# Altium project Raspberry_etherIO_v2.PrjPcb
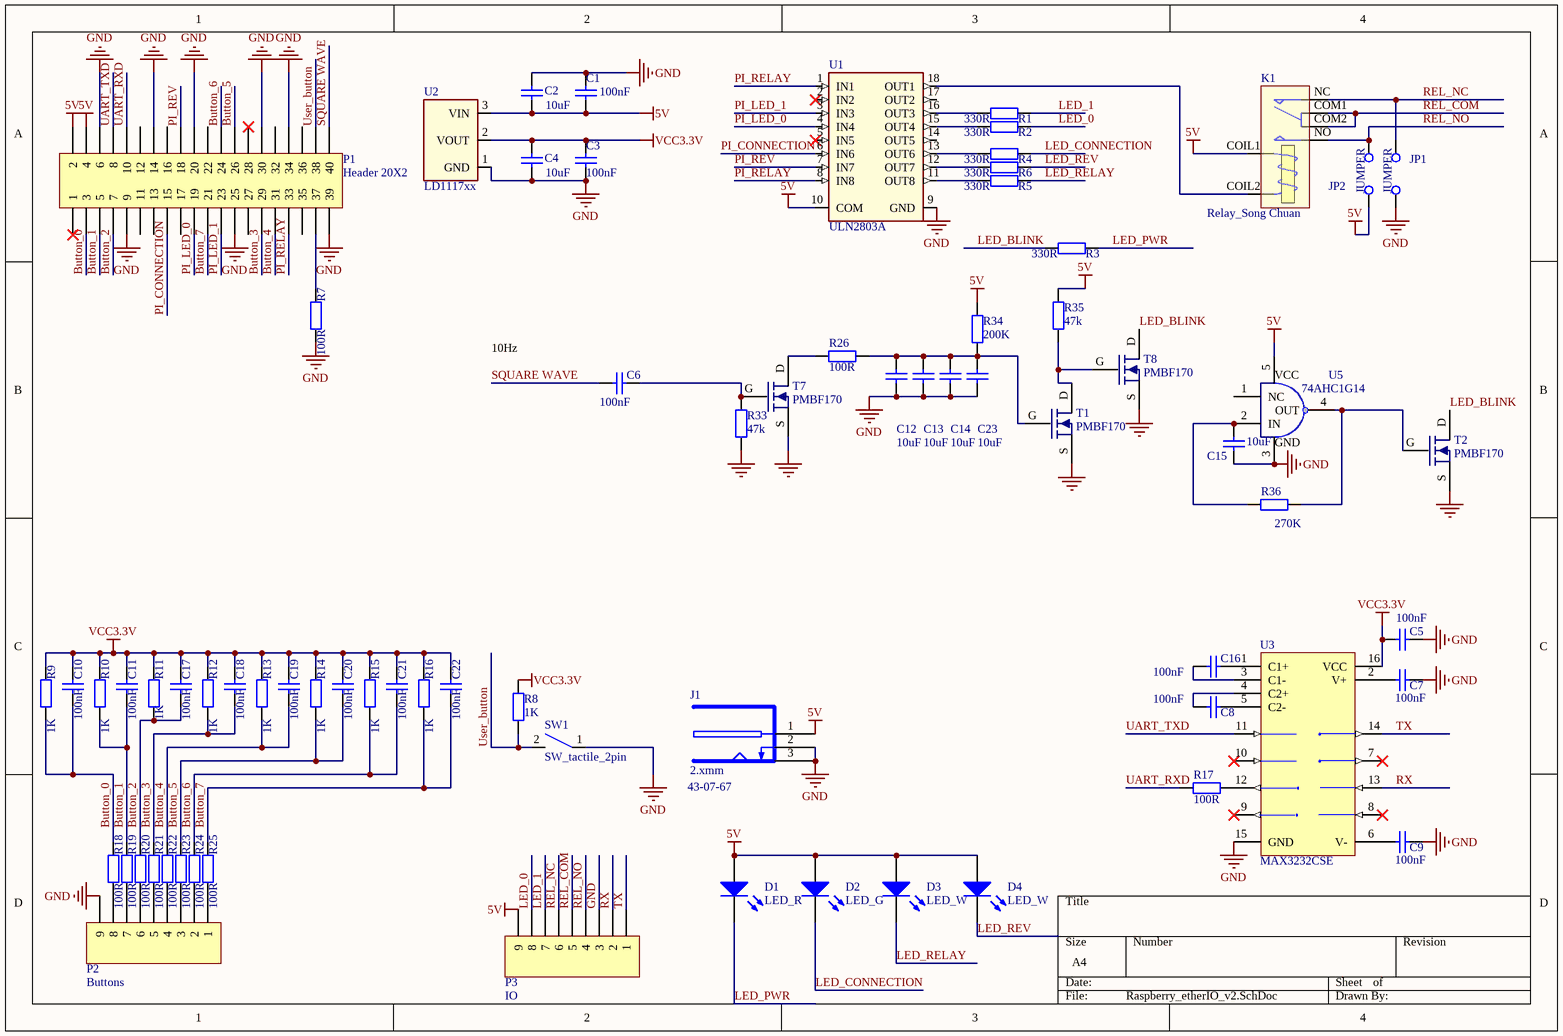
[diagram p0: Raspberry_etherIO_v2.SchDoc]
1 sheet, 73 parts. Net scope: global (net labels, ports and power ports of the same name join across sheets).
Board file: Raspberry_etherIO_v2.PcbDoc

## Sheet Raspberry_etherIO_v2.SchDoc
size A4

### Parts
C1  100nF  [FP_0603_CAP_080]
C2  10uF  [FP_1206_CAP_085]
C3  100nF  [FP_0603_CAP_080]
C4  10uF  [FP_1206_CAP_085]
C5  100nF  [FP_0603_CAP_080]
C6  100nF  [FP_0603_CAP_080]
C7  100nF  [FP_0603_CAP_080]
C8  100nF  [FP_0603_CAP_080]
C9  100nF  [FP_0603_CAP_080]
C10  100nF  [FP_0603_CAP_080]
C11  100nF  [FP_0603_CAP_080]
C12  10uF  [FP_1206_CAP_085]
C13  10uF  [FP_1206_CAP_085]
C14  10uF  [FP_1206_CAP_085]
C15  10uF  [FP_0603_CAP_080]
C16  100nF  [FP_0603_CAP_080]
C17  100nF  [FP_0603_CAP_080]
C18  100nF  [FP_0603_CAP_080]
C19  100nF  [FP_0603_CAP_080]
C20  100nF  [FP_0603_CAP_080]
C21  100nF  [FP_0603_CAP_080]
C22  100nF  [FP_0603_CAP_080]
C23  10uF  [FP_1206_CAP_085]
D1  LED_R  [1206 LED Reversed]
D2  LED_G  [1206 LED Reversed]
D3  LED_W  [1206 LED Reversed]
D4  LED_W  [1206 LED Reversed]
J1  2.xmm  Order info: 43-07-67  [FP_DC_TAP_ANYA]
JP1  JUMPER  [FP_CONN2_TUSKE_254MM]
JP2  JUMPER  [FP_CONN2_TUSKE_254MM]
K1  Relay_Song Chuan  [Relay_Song Chuan]
P1  Header 20X2  [Header_2X20_pin_2.54]
P2  Buttons  [Euroblock 3.5pitch 9P]
P3  IO  [Euroblock 3.5pitch 9P]
R1  330R  [FP_0603_RES]
R2  330R  [FP_0603_RES]
R3  330R  [FP_0603_RES]
R4  330R  [FP_0603_RES]
R5  330R  [FP_0603_RES]
R6  330R  [FP_0603_RES]
R7  100R  [FP_0603_RES]
R8  1K  [FP_0603_RES]
R9  1K  [FP_0603_RES]
R10  1K  [FP_0603_RES]
R11  1K  [FP_0603_RES]
R12  1K  [FP_0603_RES]
R13  1K  [FP_0603_RES]
R14  1K  [FP_0603_RES]
R15  1K  [FP_0603_RES]
R16  1K  [FP_0603_RES]
R17  100R  [FP_0603_RES]
R18  100R  [FP_0603_RES]
R19  100R  [FP_0603_RES]
R20  100R  [FP_0603_RES]
R21  100R  [FP_0603_RES]
R22  100R  [FP_0603_RES]
R23  100R  [FP_0603_RES]
R24  100R  [FP_0603_RES]
R25  100R  [FP_0603_RES]
R26  100R  [FP_0603_RES]
R33  47k  [FP_0603_RES]
R34  200K  [FP_0603_RES]
R35  47k  [FP_0603_RES]
R36  270K  [FP_0603_RES]
SW1  SW_tactile_2pin  [SW_TACT_2PIN]
T1  PMBF170  [FET_SOT23]
T2  PMBF170  [FET_SOT23]
T7  PMBF170  [FET_SOT23]
T8  PMBF170  [FET_SOT23]
U1  ULN2803A  [DIGITAL_SOIC18W]
U2  LD1117xx  [SUPPLY_SOT223]
U3  MAX3232CSE  [DIGITAL_SOIC16]
U5  74AHC1G14  [GATE_SOT23-5]

### Nets
5V: C1.2 C2.1 D1.1(A) D2.1(A) D3.1(A) D4.1(A) J1.1(9V) JP2.1(C1) K1.COIL1 P1.2 P1.4 P3.9 R34.2 R35.2 U1.10(COM) U2.3(VIN) U5.5(VCC)
GND: C1.1 C2.2 C3.2 C4.1 C5.2 C7.2 C9.2 C12.1 C13.1 C14.1 C15.1 C23.1 J1.2(GND) J1.3(GND) JP1.1(C1) P1.6 P1.9 P1.14 P1.20 P1.25 P1.30 P1.34 P1.39 P2.9 P3.3 R7.1 R33.1 SW1.1 T1.S T2.S T7.S T8.S U1.9(GND) U2.1(GND) U3.15(GND) U5.3(GND)
VCC3.3V: C3.1 C4.2 C5.1 C10.2 C11.2 C17.2 C18.2 C19.2 C20.2 C21.2 C22.2 R8.1 R9.2 R10.2 R11.2 R12.2 R13.2 R14.2 R15.2 R16.2 U2.2(VOUT) U3.16(VCC)
Button_0: C10.1 P1.3 R9.1 R18.2
Button_1: C11.1 P1.5 R10.1 R19.2
Button_2: C17.1 P1.7 R11.1 R20.2
Button_3: C18.1 P1.29 R12.1 R21.2
Button_4: C19.1 P1.31 R13.1 R22.2
Button_5: C20.1 P1.26 R14.1 R23.2
Button_6: C21.1 P1.24 R15.1 R24.2
Button_7: C22.1 P1.21 R16.1 R25.2
LED_0: P3.8 R2.2
LED_1: P3.7 R1.2
LED_BLINK: R3.1 T2.D T8.D
LED_CONNECTION: D2.2(K) R4.2
LED_PWR: D1.2(K) R3.2
LED_RELAY: D3.2(K) R5.2
LED_REV: D4.2(K) R6.2
PI_CONNECTION: P1.15 U1.6(IN6)
PI_LED_0: P1.19 U1.4(IN4)
PI_LED_1: P1.23 U1.3(IN3)
PI_RELAY: P1.33 U1.1(IN1) U1.8(IN8)
PI_REV: P1.18 U1.7(IN7)
REL_COM: K1.COM1(COM) K1.COM2(COM) P3.5
REL_NC: JP1.2(C2) K1.NC P3.6
REL_NO: JP2.2(C2) K1.NO P3.4
RX: P3.2 U3.13(R1IN)
SQUARE WAVE: C6.1 P1.40
TX: P3.1 U3.14(T1OUT)
UART_RXD: P1.10 R17.2
UART_TXD: P1.8 U3.11(T1IN)
User_button: P1.38 R8.2 SW1.2
NetC6_2: C6.2 R33.2 T7.G
NetC7_1: C7.1 U3.2(V+)
NetC8_1: C8.1 U3.4(C2+)
NetC8_2: C8.2 U3.5(C2-)
NetC9_1: C9.1 U3.6(V-)
NetC12_2: C12.2 C13.2 C14.2 C23.2 R26.1 R34.1 T1.G
NetC15_2: C15.2 R36.2 U5.2(IN)
NetC16_1: C16.1 U3.3(C1-)
NetC16_2: C16.2 U3.1(C1+)
NetK1_COIL2: K1.COIL2 U1.18(OUT1)
NetP1_37: P1.37 R7.2
NetP2_1: P2.1 R25.1
NetP2_2: P2.2 R24.1
NetP2_3: P2.3 R23.1
NetP2_4: P2.4 R22.1
NetP2_5: P2.5 R21.1
NetP2_6: P2.6 R20.1
NetP2_7: P2.7 R19.1
NetP2_8: P2.8 R18.1
NetR1_1: R1.1 U1.16(OUT3)
NetR2_1: R2.1 U1.15(OUT4)
NetR4_1: R4.1 U1.13(OUT6)
NetR5_1: R5.1 U1.11(OUT8)
NetR6_1: R6.1 U1.12(OUT7)
NetR17_1: R17.1 U3.12(R1OUT)
NetR26_2: R26.2 T7.D
NetR35_1: R35.1 T1.D T8.G
NetR36_1: R36.1 T2.G U5.4(OUT)

Not connected (* = marked no-connect by the designer): P1 1* 11 12 13 16 17 22 27 28* 32 35 36; U1 2(IN2)* 5(IN5)* 14(OUT5) 17(OUT2); U3 7(T2OUT)* 8(R2IN)* 9(R2OUT)* 10(T2IN)*; U5 1(NC)

### Notes on the sheet
- 10Hz

### Library data of the parts
C1 C3 = Cap: Capacitor; Tűrés: 10%; Published: 8-Jun-2000; LatestRevisionDate: 17-Jul-2002; LatestRevisionNote: Re-released for DXP Platform.; PackageReference: RAD-0.3; Publisher: Altium Limited; Value: 100nF; Order info: 82-04-85
C2 C4 C12-C14 C23 = Cap: Capacitor; Tűrés: 20% X7R; Order info: TODO; Published: 8-Jun-2000; LatestRevisionDate: 17-Jul-2002; LatestRevisionNote: Re-released for DXP Platform.; PackageReference: RAD-0.3; Publisher: Altium Limited; Value: 10uF; Order info: 82-08-03
C5-C11 C16-C22 = CAP: Capacitor; Value: 100nF; Order info: 82-04-85
C15 = Cap: Capacitor; Value: 22p; Tűrés: 10%; Published: 8-Jun-2000; LatestRevisionDate: 17-Jul-2002; LatestRevisionNote: Re-released for DXP Platform.; PackageReference: RAD-0.3; Publisher: Altium Limited; Order info: 82-07-81
D1-D4 = LED: Typical LED; pin to pad: 1>A 2>K
  D1: Order info: 95-01-12
  D2: Order info: 95-02-99
  D3 D4: Order info: 95-02-03
J1 = DC_TAP_ANYA: 2.xmm DC HEBA25 TÁPFESZÜLTSÉG ALJZAT ZÁRT, NYÁKBA 90°
JP1 JP2 = JUMPER: Jumper Wire; Supplier: Farnell 1668537×1/6; Order info: 43-17-58
K1 = Relay_Song Chuan: SPDT Relay; Published: 8-Jun-2000; LatestRevisionDate: 17-Jul-2002; LatestRevisionNote: Re-released for DXP Platform.; PackageReference: MODULE5B; Publisher: Altium Limited; Order info: 42-16-40
P1 = Header 20X2: Header, 20-Pin, Dual row; LatestRevisionDate: 17-Jul-2002; LatestRevisionNote: Re-released for DXP Platform.; Publisher: Altium Limited; Order info: 43-06-67
P2 P3 = Header 9: Header, 9-Pin; Order info: Euroblock csatlakozó; LatestRevisionDate: 17-Jul-2002; LatestRevisionNote: Re-released for DXP Platform.; Publisher: Altium Limited
R1-R26 R33-R35 = RES: Resistor
  R1-R6: Value: 330R; Order info: 80-11-57
  R7 R17-R26: Value: 100R; Order info: 81-10-16
  R8-R16: Value: 1K; Order info: 81-10-26
  R33 R35: Value: 47k; Order info: 81-10-46
  R34: Value: 200K; Order info: 81-12-59
R36 = Res3: Resistor; Tűrés: 5%; Published: 8-Jun-2000; LatestRevisionDate: 04-Mar-2005; LatestRevisionNote: PCB Footprint replaced.; PackageReference: J1-0603; Publisher: Altium Limited; Value: 270K; Order info: 80-15-22
T1 T2 T7 T8 = NMOS: Order info: 86-01-96
U1 = ULN280x: Order info: 89-04-73
U2 = LD1117xx: LD1117xx 3,3V lin reg; Order info: 89-06-98
U3 = MAX3232CSE: 3.0V TO 5.5V, Low-Power, up to 1Mbps, True RS-232 Transceiver Using Four 0.1µF External Capacitor; Published: 16-Jan-2001; LatestRevisionDate: 13-Apr-2006; LatestRevisionNote: IPC-7351 Footprint Added.; DatasheetVersion: Mar-1999; PackageReference: NSO16; Publisher: Altium Limited; PackageDescription: 16-Pin Small Outline Integrated Circuit 1.27 mm Pitch; Code_JEDEC: MS-012-AC; Code_IPC: SOIC127P600-16; ComponentLink1Description: Manufacturer Link; ComponentLink1URL: http://www.maxim-ic.com/; ComponentLink2Description: Datasheet; ComponentLink2URL: http://pdfserv.maxim-ic.com/en/ds/MAX3222-MAX3241.pdf; Order info: 89-12-11
U5 = 74AHC1G14: SCHMITT-TRIGGER INVERTER; Order info: 87-03-90
SW1 = SW_tactile_2pin: Order info: 45-07-27